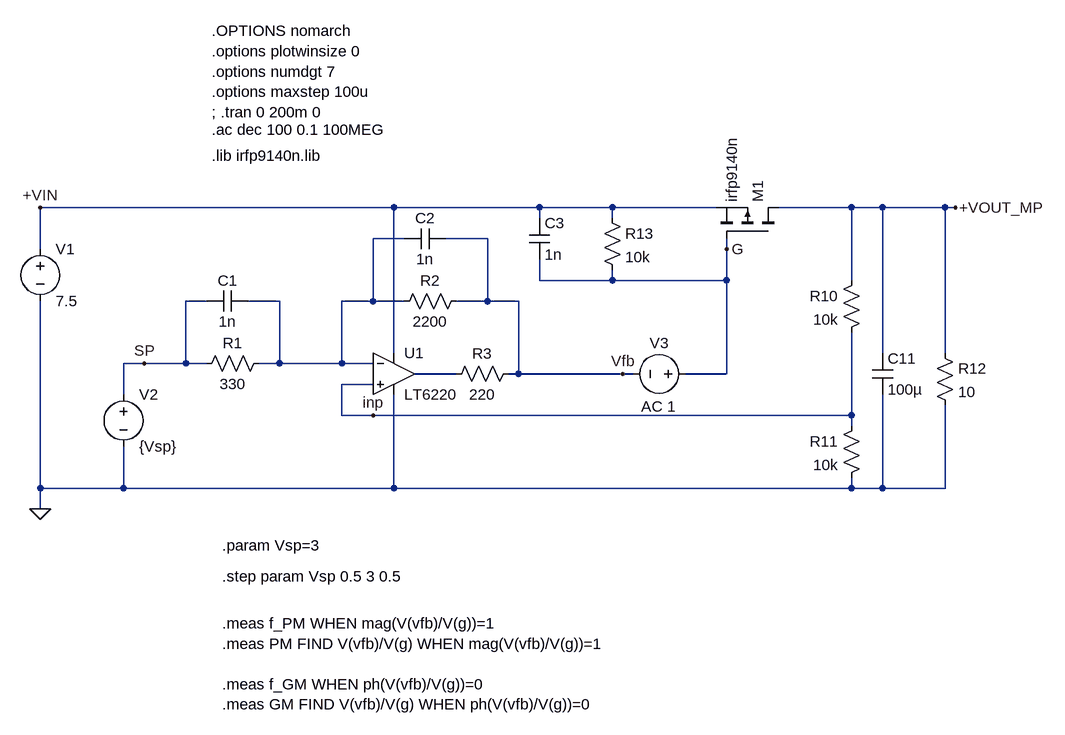
[diagram p0: schematic PMOS_lin_reg - irf9140n_V3 - kopie.asc]
PMOS_lin_reg - irf9140n_V3 - kopie.asc, the LTspice schematic file:
Version 4
SHEET 1 4944 2476
WIRE 944 -2144 400 -2144
WIRE 1168 -2144 944 -2144
WIRE 1280 -2144 1168 -2144
WIRE 1440 -2144 1280 -2144
WIRE 1648 -2144 1536 -2144
WIRE 1696 -2144 1648 -2144
WIRE 1792 -2144 1696 -2144
WIRE 1808 -2144 1792 -2144
WIRE 1168 -2128 1168 -2144
WIRE 1280 -2128 1280 -2144
WIRE 960 -2096 912 -2096
WIRE 1088 -2096 1024 -2096
WIRE 400 -2080 400 -2144
WIRE 1456 -2080 1456 -2096
WIRE 1168 -2032 1168 -2064
WIRE 1280 -2032 1280 -2048
WIRE 1280 -2032 1168 -2032
WIRE 1456 -2032 1456 -2080
WIRE 1456 -2032 1280 -2032
WIRE 1648 -2032 1648 -2144
WIRE 656 -2000 624 -2000
WIRE 768 -2000 720 -2000
WIRE 912 -2000 912 -2096
WIRE 912 -2000 864 -2000
WIRE 960 -2000 912 -2000
WIRE 1088 -2000 1088 -2096
WIRE 1088 -2000 1040 -2000
WIRE 1136 -2000 1088 -2000
WIRE 944 -1920 944 -2144
WIRE 1696 -1920 1696 -2144
WIRE 1792 -1920 1792 -2144
WIRE 560 -1904 528 -1904
WIRE 624 -1904 624 -2000
WIRE 624 -1904 560 -1904
WIRE 656 -1904 624 -1904
WIRE 768 -1904 768 -2000
WIRE 768 -1904 736 -1904
WIRE 864 -1904 864 -2000
WIRE 864 -1904 768 -1904
WIRE 912 -1904 864 -1904
WIRE 1040 -1888 976 -1888
WIRE 1136 -1888 1136 -2000
WIRE 1136 -1888 1120 -1888
WIRE 1296 -1888 1136 -1888
WIRE 1312 -1888 1296 -1888
WIRE 1456 -1888 1456 -2032
WIRE 1456 -1888 1392 -1888
WIRE 912 -1872 864 -1872
WIRE 528 -1856 528 -1904
WIRE 864 -1824 864 -1872
WIRE 912 -1824 864 -1824
WIRE 1648 -1824 1648 -1952
WIRE 1648 -1824 912 -1824
WIRE 1648 -1808 1648 -1824
WIRE 400 -1712 400 -2000
WIRE 528 -1712 528 -1776
WIRE 528 -1712 400 -1712
WIRE 944 -1712 944 -1856
WIRE 944 -1712 528 -1712
WIRE 1648 -1712 1648 -1728
WIRE 1648 -1712 944 -1712
WIRE 1696 -1712 1696 -1856
WIRE 1696 -1712 1648 -1712
WIRE 1792 -1712 1792 -1840
WIRE 1792 -1712 1696 -1712
WIRE 400 -1680 400 -1712
FLAG 400 -2144 +VIN
FLAG 560 -1904 SP
FLAG 1808 -2144 +VOUT_MP
FLAG 1456 -2080 G
FLAG 1296 -1888 Vfb
FLAG 912 -1824 inp
FLAG 400 -1680 0
DATAFLAG 1744 -2144 "round($/1m)*1m"
DATAFLAG 896 -2144 "round($/1m)*1m"
DATAFLAG 1232 -1888 "round($/1m)*1m"
DATAFLAG 1136 -1824 "round($/1m)*1m"
DATAFLAG 816 -1904 "round($/1m)*1m"
DATAFLAG 1376 -2032 "round($/1m)*1m"
SYMBOL cap 1680 -1920 R0
SYMATTR InstName C11
SYMATTR Value 100µ
SYMATTR SpiceLine Rser=10m
SYMBOL res 1664 -2048 M0
SYMATTR InstName R10
SYMATTR Value 10k
SYMBOL res 1664 -1824 M0
SYMATTR InstName R11
SYMATTR Value 10k
SYMBOL OpAmps\\LT6220 944 -1888 R0
SYMATTR InstName U1
SYMBOL res 1776 -1936 R0
SYMATTR InstName R12
SYMATTR Value 10
SYMBOL pmos 1536 -2096 M270
SYMATTR InstName M1
SYMATTR Value irfp9140n
SYMATTR Prefix X
SYMBOL res 1264 -2144 R0
SYMATTR InstName R13
SYMATTR Value 10k
SYMBOL voltage 400 -2096 R0
SYMATTR InstName V1
SYMATTR Value 7.5
SYMBOL voltage 528 -1872 R0
SYMATTR InstName V2
SYMATTR Value {Vsp}
SYMBOL voltage 1408 -1888 R90
WINDOW 0 -32 56 VBottom 2
WINDOW 3 32 56 Invisible 2
WINDOW 123 66 57 VBottom 2
WINDOW 39 0 0 Left 0
SYMATTR InstName V3
SYMATTR Value 0
SYMATTR Value2 AC 1
SYMBOL cap 720 -2016 R90
WINDOW 0 0 32 VBottom 2
WINDOW 3 32 32 VTop 2
SYMATTR InstName C1
SYMATTR Value 1n
SYMBOL res 752 -1920 R90
WINDOW 0 0 56 VBottom 2
WINDOW 3 32 56 VTop 2
SYMATTR InstName R1
SYMATTR Value 330
SYMBOL cap 1024 -2112 R90
WINDOW 0 0 32 VBottom 2
WINDOW 3 32 32 VTop 2
SYMATTR InstName C2
SYMATTR Value 1n
SYMBOL res 1056 -2016 R90
WINDOW 0 0 56 VBottom 2
WINDOW 3 32 56 VTop 2
SYMATTR InstName R2
SYMATTR Value 2200
SYMBOL res 1136 -1904 R90
WINDOW 0 0 56 VBottom 2
WINDOW 3 32 56 VTop 2
SYMATTR InstName R3
SYMATTR Value 220
SYMBOL cap 1152 -2128 R0
SYMATTR InstName C3
SYMATTR Value 1n
SYMATTR SpiceLine Rser=10m
TEXT 664 -2416 Left 2 !.OPTIONS nomarch\n.options plotwinsize 0\n.options numdgt 7\n.options maxstep 100u\n; .tran 0 200m 0
TEXT 664 -2264 Left 2 !.ac dec 100 0.1 100MEG
TEXT 664 -2224 Left 2 !.lib irfp9140n.lib
TEXT 680 -1504 Left 2 !.meas f_PM WHEN mag(V(vfb)/V(g))=1\n.meas PM FIND V(vfb)/V(g) WHEN mag(V(vfb)/V(g))=1\n \n.meas f_GM WHEN ph(V(vfb)/V(g))=0\n.meas GM FIND V(vfb)/V(g) WHEN ph(V(vfb)/V(g))=0
TEXT 680 -1624 Left 2 !.param Vsp=3
TEXT 680 -1576 Left 2 !.step param Vsp 0.5 3 0.5

The netlist it stands for:
* PMOS_lin_reg - irf9140n_V3 - kopie.asc
C11 +VOUT_MP 0 100µ Rser=10m
R10 +VOUT_MP inp 10k
R11 inp 0 10k
XU1 inp N001 +VIN 0 N002 LT6220  ; pins In+ In- V+ V- OUT
R12 +VOUT_MP 0 10
XM1 +VOUT_MP G +VIN irfp9140n  ; pins D G S
R13 +VIN G 10k
V1 +VIN 0 7.5
V2 SP 0 {Vsp}
V3 G Vfb 0 AC 1
C1 N001 SP 1n
R1 N001 SP 330
C2 Vfb N001 1n
R2 Vfb N001 2200
R3 Vfb N002 220
C3 +VIN G 1n Rser=10m
.OPTIONS nomarch
.options plotwinsize 0
.options numdgt 7
.options maxstep 100u
; .tran 0 200m 0
.ac dec 100 0.1 100MEG
.lib irfp9140n.lib
.meas f_PM WHEN mag(V(vfb)/V(g))=1
.meas PM FIND V(vfb)/V(g) WHEN mag(V(vfb)/V(g))=1
.meas f_GM WHEN ph(V(vfb)/V(g))=0
.meas GM FIND V(vfb)/V(g) WHEN ph(V(vfb)/V(g))=0
.param Vsp=3
.step param Vsp 0.5 3 0.5
.lib LTC4.lib
.backanno
.end